# EAGLE design TriggerPI (EAGLE 6.5.0)
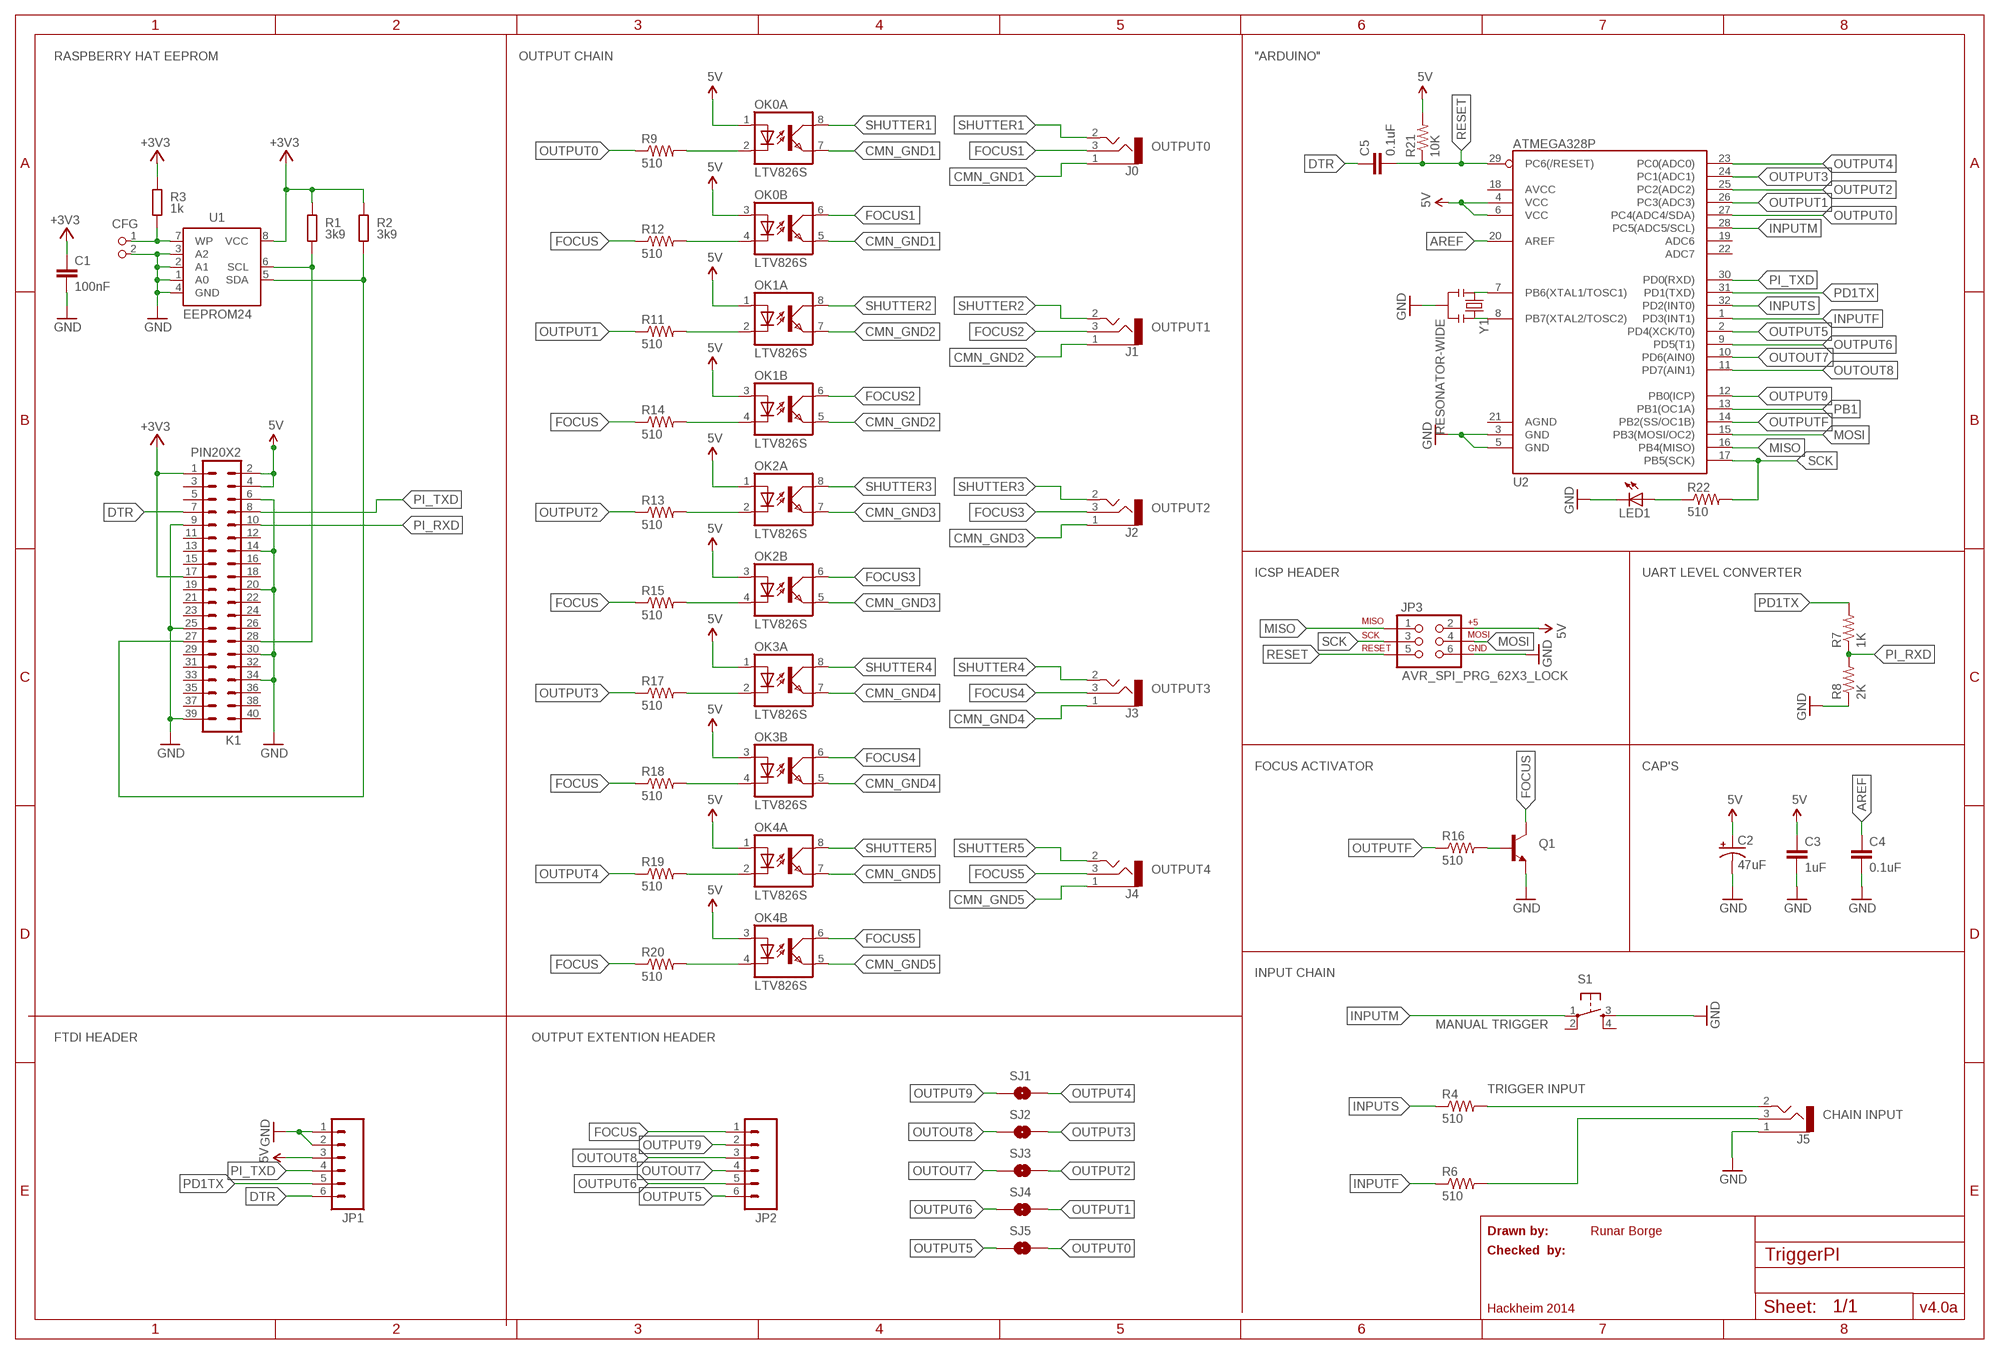
[diagram p0: schematic, sheet 1]

## Parts
C1  100nF  C-EUC0805K  [C0805K]
C2  47uF  47UF-TANT  [EIA3528]
C3  1uF  1UF-25V-10%(0805)  [0805]
C4  0.1uF  CAP0603-CAP  [0603-CAP]
C5  0.1uF  CAP0603-CAP  [0603-CAP]
CFG  PIN2_100  [PIN_W_2]
J0  AUDIO-3P'SJ-3523-SMT'  [3P-SMD-3.5]
J1  AUDIO-3P'SJ-3523-SMT'  [3P-SMD-3.5]
J2  AUDIO-3P'SJ-3523-SMT'  [3P-SMD-3.5]
J3  AUDIO-3P'SJ-3523-SMT'  [3P-SMD-3.5]
J4  AUDIO-3P'SJ-3523-SMT'  [3P-SMD-3.5]
J5  AUDIO-3P'SJ-3523-SMT'  [3P-SMD-3.5]
JP1  M06LOCK  [1X06_LOCK]
JP2  M06LOCK  [1X06_LOCK]
JP3  AVR_SPI_PRG_62X3_LOCK  [2X3_LOCK]
K1  PIN20X2  [PIN_20X2]
LED1  LED1206  [LED-1206]
OK0  LTV826S  [DIL8-SMD]
OK1  LTV826S  [DIL8-SMD]
OK2  LTV826S  [DIL8-SMD]
OK3  LTV826S  [DIL8-SMD]
OK4  LTV826S  [DIL8-SMD]
Q1  TRANSISTOR_NPNSOT23-3  [SOT23-3]
R1  3k9  R-EU_M0805  [M0805]
R2  3k9  R-EU_M0805  [M0805]
R3  1k  R-EU_M0805  [M0805]
R4  510  RESISTOR0603-RES  [0603-RES]
R6  510  RESISTOR0603-RES  [0603-RES]
R7  1K  RESISTOR0603-RES  [0603-RES]
R8  2K  RESISTOR0603-RES  [0603-RES]
R9  510  RESISTOR0603-RES  [0603-RES]
R11  510  RESISTOR0603-RES  [0603-RES]
R12  510  RESISTOR0603-RES  [0603-RES]
R13  510  RESISTOR0603-RES  [0603-RES]
R14  510  RESISTOR0603-RES  [0603-RES]
R15  510  RESISTOR0603-RES  [0603-RES]
R16  510  RESISTOR0603-RES  [0603-RES]
R17  510  RESISTOR0603-RES  [0603-RES]
R18  510  RESISTOR0603-RES  [0603-RES]
R19  510  RESISTOR0603-RES  [0603-RES]
R20  510  RESISTOR0603-RES  [0603-RES]
R21  10K  RESISTOR0603-RES  [0603-RES]
R22  510  RESISTOR0603-RES  [0603-RES]
S1  TAC_SWITCHSMD  [TACTILE_SWITCH_SMD]
SJ1  JUMPER-PAD-2-NOYES_SILK  [PAD-JUMPER-2-NO_YES_SILK]
SJ2  JUMPER-PAD-2-NOYES_SILK  [PAD-JUMPER-2-NO_YES_SILK]
SJ3  JUMPER-PAD-2-NOYES_SILK  [PAD-JUMPER-2-NO_YES_SILK]
SJ4  JUMPER-PAD-2-NOYES_SILK  [PAD-JUMPER-2-NO_YES_SILK]
SJ5  JUMPER-PAD-2-NOYES_SILK  [PAD-JUMPER-2-NO_YES_SILK]
U1  EEPROM24  [SOIC8]
U2  ATMEGA328P  ATMEGA328_SMT  [TQFP32-08]
Y1  RESONATOR-WIDE  [RESONATOR-WIDE-SMD]

## Nets
5V: C2.A(+) C3.1 JP1.3 JP3.2 K1.2 K1.4 OK0.1(A:A) OK0.3(B:A) OK1.1(A:A) OK1.3(B:A) OK2.1(A:A) OK2.3(B:A) OK3.1(A:A) OK3.3(B:A) OK4.1(A:A) OK4.3(B:A) R21.2 U2.4(VCC) U2.6(VCC)
+3V3: C1.1 K1.1 K1.17 R1.2 R2.2 R3.2 U1.8(VCC)
AREF: C4.1 U2.20(AREF)
CMN_GND1: J0.1 OK0.5(B:EMIT) OK0.7(A:EMIT)
CMN_GND2: J1.1 OK1.5(B:EMIT) OK1.7(A:EMIT)
CMN_GND3: J2.1 OK2.5(B:EMIT) OK2.7(A:EMIT)
CMN_GND4: J3.1 OK3.5(B:EMIT) OK3.7(A:EMIT)
CMN_GND5: J4.1 OK4.5(B:EMIT) OK4.7(A:EMIT)
DTR: C5.1 JP1.6 K1.7
FOCUS: JP2.1 Q1.3(C) R12.1 R14.1 R15.1 R18.1 R20.1
FOCUS0: J5.3 R6.2
FOCUS1: J0.3 OK0.6(B:COL)
FOCUS2: J1.3 OK1.6(B:COL)
FOCUS3: J2.3 OK2.6(B:COL)
FOCUS4: J3.3 OK3.6(B:COL)
FOCUS5: J4.3 OK4.6(B:COL)
GND: C1.2 C2.C(-) C3.2 C4.2 CFG.2 J5.1 JP1.1 JP1.2 JP3.6 K1.6 K1.9 K1.14 K1.20 K1.25 K1.30 K1.34 K1.39 LED1.C Q1.2(E) R8.1 S1.3 U1.1(A0) U1.2(A1) U1.3(A2) U1.4(GND) U2.3(GND) U2.5(GND) Y1.2
INPUTF: R6.1 U2.1(PD3(INT1))
INPUTM: S1.1 U2.28(PC5(ADC5/SCL))
INPUTS: R4.1 U2.32(PD2(INT0))
MISO: JP3.1 U2.16(PB4(MISO))
MOSI: JP3.4 U2.15(PB3(MOSI/OC2))
N$1: K1.28 R1.1 U1.6(SCL)
N$2: K1.27 R2.1 U1.5(SDA)
N$3: CFG.1 R3.1 U1.7(WP)
N$4: J5.2 R4.2
N$7: OK0.2(A:C) R9.2
N$9: OK1.2(A:C) R11.2
N$11: OK2.2(A:C) R13.2
N$12: OK0.4(B:C) R12.2
N$13: Q1.1(B) R16.2
N$14: OK3.2(A:C) R17.2
N$17: OK3.4(B:C) R18.2
N$18: OK4.2(A:C) R19.2
N$19: OK4.4(B:C) R20.2
N$20: U2.7(PB6(XTAL1/TOSC1)) Y1.1
N$21: U2.8(PB7(XTAL2/TOSC2)) Y1.3
N$24: LED1.A R22.1
N$26: OK1.4(B:C) R14.2
N$28: OK2.4(B:C) R15.2
OUTOUT7: JP2.4 SJ3.1 U2.10(PD6(AIN0))
OUTOUT8: JP2.3 SJ2.1 U2.11(PD7(AIN1))
OUTPUT0: R9.1 SJ5.2 U2.27(PC4(ADC4/SDA))
OUTPUT1: R11.1 SJ4.2 U2.26(PC3(ADC3))
OUTPUT2: R13.1 SJ3.2 U2.25(PC2(ADC2))
OUTPUT3: R17.1 SJ2.2 U2.24(PC1(ADC1))
OUTPUT4: R19.1 SJ1.2 U2.23(PC0(ADC0))
OUTPUT5: JP2.6 SJ5.1 U2.2(PD4(XCK/T0))
OUTPUT6: JP2.5 SJ4.1 U2.9(PD5(T1))
OUTPUT9: JP2.2 SJ1.1 U2.12(PB0(ICP))
OUTPUTF: R16.1 U2.14(PB2(SS/OC1B))
PB1: U2.13(PB1(OC1A))
PD1TX: JP1.5 R7.2 U2.31(PD1(TXD))
PI_RXD: K1.10 R7.1 R8.2
PI_TXD: JP1.4 K1.8 U2.30(PD0(RXD))
RESET: C5.2 JP3.5 R21.1 U2.29(PC6(/RESET))
SCK: JP3.3 R22.2 U2.17(PB5(SCK))
SHUTTER1: J0.2 OK0.8(A:COL)
SHUTTER2: J1.2 OK1.8(A:COL)
SHUTTER3: J2.2 OK2.8(A:COL)
SHUTTER4: J3.2 OK3.8(A:COL)
SHUTTER5: J4.2 OK4.8(A:COL)
Unconnected: K1.3 K1.5 K1.11 K1.12 K1.13 K1.15 K1.16 K1.18 K1.19 K1.21 K1.22 K1.23 K1.24 K1.26 K1.29 K1.31 K1.32 K1.33 K1.35 K1.36 K1.37 K1.38 K1.40 S1.2 S1.4 U2.18(AVCC) U2.19(ADC6) U2.21(AGND) U2.22(ADC7)

## Notes on the sheet
- RASPBERRY HAT EEPROM | OUTPUT CHAIN | "ARDUINO"
- OUTPUT0
- OUTPUT1
- OUTPUT2
- ICSP HEADER | UART LEVEL CONVERTER
- OUTPUT3
- FOCUS ACTIVATOR | CAP'S
- OUTPUT4
- INPUT CHAIN
- MANUAL TRIGGER
- FTDI HEADER | OUTPUT EXTENTION HEADER
- TRIGGER INPUT
- CHAIN INPUT
- Drawn by: | Runar Borge
- Checked  by:
- Hackheim 2014 | v4.0a

## Library data of the parts
C1 = resistor:C-EU: CAPACITOR, European symbol; DIELECTRIC: X7R
C2 = SparkFun-Capacitors:47UF-TANT: 47uF Tantalum SMT CAP-08310- 10V 10% (EIA-3528); DIGIKEY: 478-3132-1-ND; PROD_ID: CAP-08310
C3 = SparkFun-Capacitors:1UF-25V-10%(0805): CAP-08064; DIGIKEY: 445-7547-1-ND; PROD_ID: CAP-08064
C4 C5 = SparkFun-Capacitors:CAP: Capacitor Standard 0603 ceramic capacitor, and 0.1" leaded capacitor.; DIGIKEY: 445-1314-1-ND
CFG = FLYFISH:PIN2
J0 J1-J5 = Connector:AUDIO-3P: 3.5mm Audio Jack Simple 3.5mm common PCB mount audio jack. SKU: PRT-08032; DIGIKEY: CP-3523SJCT-ND
JP1 JP2 = SparkFun-Connectors:M06: Header 6 Standard 6-pin 0.1" header. Use with straight break away headers (SKU : PRT-00116), right angle break away headers (PRT-00553), swiss pins (PRT-00743), machine pins (PRT-00117), and female headers (PRT-00115). Molex polarized connector foot print use with SKU : PRT-08094 with associated crimp pins and housings. NOTES ON THE VARIANTS LOCK and LOCK_LONGPADS... This footprint was designed to help hold the alignment of a through-hole component (i.e. 6-pin header) while soldering it into place. You may notice that each hole has been shifted either up or down by 0.005 of an inch from it's more standard position (which is a perfectly straight line). This slight alteration caused the pins (the squares in the middle) to touch the edges of the holes. Because they are alternating, it causes a "brace" to hold the component in place. 0.005 has proven to be the perfect amount of "off-center" position when using our standard breakaway headers. Although looks a little odd when you look at the bare footprint, once you have a header in there, the alteration is very hard to notice. Also,if you push a header all the way into place, it is covered up entirely on the bottom side. This idea of altering the position of holes to aid alignment will be further integrated into the Sparkfun Library for other footprints. It can help hold any component with 3 or more connection pins.
JP3 = SparkFun-Connectors:AVR_SPI_PRG_6: AVR ISP 6 Pin This is the reduced ISP connector for AVR programming. Common on Arduino. This footprint will take up less PCB space and can be used with a 10-pin to 6-pin adapter such as SKU: BOB-08508
K1 = FLYFISH:PIN20X2
LED1 = SparkFun-LED:LED: LEDs Standard schematic elements and footprints for 5mm, 3mm, 1206, and 0603 sized LEDs. 5mm - Spark Fun Electronics SKU : COM-00529 (and others); DIGIKEY: 160-1405-1-ND
OK0 OK1-OK4 = optocoupler:LTV826: OPTO COUPLER Source: LITEON, LTV816.pdf; DIGIKEY: 160-1363-5-ND; OC_FARNELL: unknown; OC_NEWARK: unknown
Q1 = SparkFun-DiscreteSemi:TRANSISTOR_NPN: Generic NPN BJT. MMBT2222 is the common NPN we use. Double check against datasheet- not all devices are the same!; DIGIKEY: MMBT2222A-FDICT-ND
R1-R3 = resistor:R-EU_: RESISTOR, European symbol; TOLERANCE: 5%
R4 R6 R9 R11-R20 R22 = SparkFun-Passives:RESISTOR: Resistor Basic schematic elements and footprints for 0603, 1206, and PTH resistors.; DIGIKEY: RMCF0603JT510RCT-ND
R7 = SparkFun-Passives:RESISTOR: Resistor Basic schematic elements and footprints for 0603, 1206, and PTH resistors.; DIGIKEY: RMCF0603JT1K00CT-ND
R8 = SparkFun-Passives:RESISTOR: Resistor Basic schematic elements and footprints for 0603, 1206, and PTH resistors.; DIGIKEY: RMCF0603JT2K00CT-ND
R21 = SparkFun-Passives:RESISTOR: Resistor Basic schematic elements and footprints for 0603, 1206, and PTH resistors.; DIGIKEY: RMCF0603JT10K0CT-ND
S1 = SparkFun-Electromechanical:TAC_SWITCH: Momentary Switch Button commonly used for reset or general input. Spark Fun Electronics SKU : COM-00097 SMT- SWCH-08247; DIGIKEY: CKN9104CT-ND; PROD_ID: SWCH-08247
SJ1-SJ5 = SparkFun-Passives:JUMPER-PAD-2-NO
U1 = FLYFISH:EEPROM24
U2 = SparkFun-DigitalIC (Runars-iMac's conflicted copy 2013-11-01):ATMEGA328_SMT: 32-Pin Atmega328 part Commonly used on Arduino compatible boards Available in QFP and QFN packages TQFP is IC-09069 QFN is non-stock; DIGIKEY: ATMEGA328P-AURCT-ND; PROD_ID: IC-09069
Y1 = SparkFun-FreqCtrl:RESONATOR-WIDE; DIGIKEY: 1253-1084-1-ND

## Board
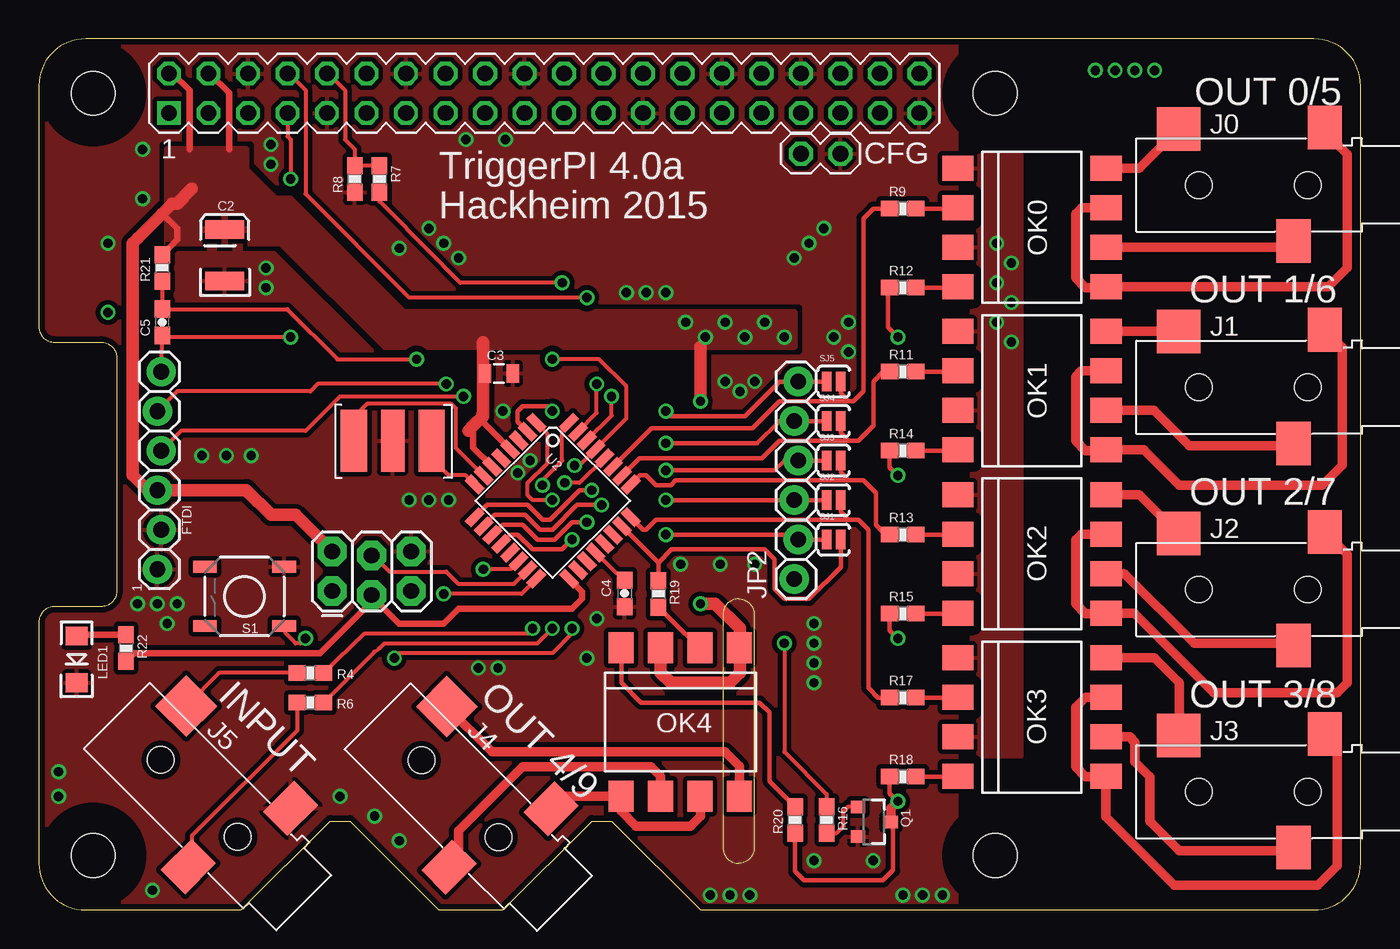
[diagram p1: board, top side]
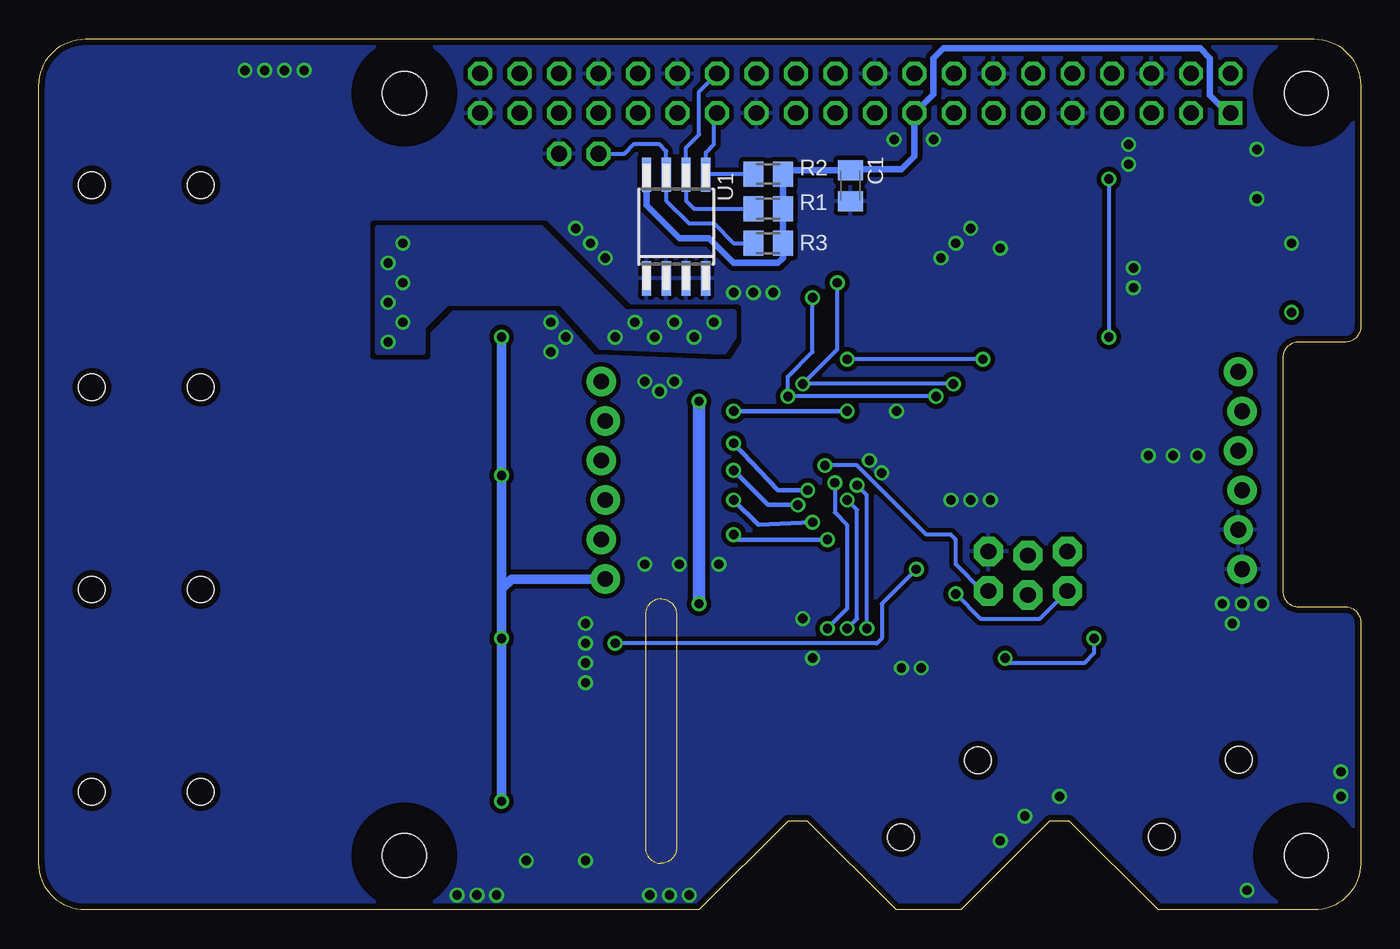
[diagram p2: board, bottom side, seen from below]

Size 85 x 56 mm. Coordinates in mm from the lower left corner, seen from the top.
Outline: 0,3 arc90 3,0 13.02,0 18.73,5.71 20,5.71 25.72,0 29.84,0 35.56,5.71 36.83,5.71 42.55,0 82,0 arc90 85,3 85,53 arc90 82,56 3,56 arc90 0,53 0,37.5 arc90 1,36.5 4,36.5 arc-90 5,35.5 5,20.5 arc-90 4,19.5 1,19.5 arc90 0,18.5 0,3
Copper layers (1*16): Top 0.0356mm / dielectric 1.5011mm / Bottom 0.0356mm
Design rules "OSHPark - LaenPCBOrder": minimum track width 6mil, minimum drill 13mil, track to track 6mil, track to pad 6mil, pad to pad 6mil, via to via 6mil, smd to smd 6mil, copper to edge 15mil, drill to drill 6mil, minimum pad ring 7mil, minimum via ring 7mil, stop-mask expansion 4mil, vias tented up to drill 0mil, thermal gap 10mil
Holes 2.8 mm at 3.5,3.5 3.5,52.5 61.5,52.5 61.5,3.5
tRestrict: area 1.9,51 to 5,54; area 60,51 to 63,54; area 60,1.9 to 63,5; area 1.9,1.9 to 5,5
bRestrict: area 1.9,1.9 to 5,5; area 1.9,51 to 5,54; area 60,1.9 to 63,5; area 60,51 to 63,54
Milling: 6 lines

### Footprints (pad centres in the part's own frame; a part is rotated, then mirrored left to right if it is on the bottom)
C0805K = smd 1.3 x 1.6: 1 -1,0; 2 1,0
EIA3528 = smd 1.2 x 2.5: A 1.65,0; C -1.65,0
0805 = smd 0.8 x 1.2: 1 -0.9,0; 2 0.9,0
0603-CAP = smd 1.1 x 1: 1 -0.85,0; 2 0.85,0
PIN_W_2 = drill 1.016 octagon: 1 0,0; 2 0,-2.54
3P-SMD-3.5 = smd 2.2 x 2.8: 1 4.6,3.7; 3 2.6,-3.6 | smd 2.8 x 2.8: 2 -4.8,3.6 | hole 1.7: -3.5,0; 3.5,0
1X06_LOCK = drill 1.016 pad 1.88: 1 0,0; 2 2.54,-0.254; 3 5.08,0; 4 7.62,-0.254; 5 10.16,0; 6 12.7,-0.254
2X3_LOCK = drill 1.016 pad 1.88 octagon: 1 0,0; 2 0,2.54; 3 2.54,-0.254; 4 2.54,2.286; 5 5.08,0; 6 5.08,2.54
PIN_20X2 = drill 1.016 square: 1 -24.13,-1.27 | drill 1.016 octagon: 2 -24.13,1.27; 3 -21.59,-1.27; 4 -21.59,1.27; 5 -19.05,-1.27; 6 -19.05,1.27; 7 -16.51,-1.27; 8 -16.51,1.27; 9 -13.97,-1.27; 10 -13.97,1.27; 11 -11.43,-1.27; 12 -11.43,1.27; 13 -8.89,-1.27; 14 -8.89,1.27; 15 -6.35,-1.27; 16 -6.35,1.27; 17 -3.81,-1.27; 18 -3.81,1.27; 19 -1.27,-1.27; 20 -1.27,1.27; 21 1.27,-1.27; 22 1.27,1.27; 23 3.81,-1.27; 24 3.81,1.27; 25 6.35,-1.27; 26 6.35,1.27; 27 8.89,-1.27; 28 8.89,1.27; 29 11.43,-1.27; 30 11.43,1.27; 31 13.97,-1.27; 32 13.97,1.27; 33 16.51,-1.27; 34 16.51,1.27; 35 19.05,-1.27; 36 19.05,1.27; 37 21.59,-1.27; 38 21.59,1.27; 39 24.13,-1.27; 40 24.13,1.27
LED-1206 = smd 1.2 x 1.4: A -1.5,0; C 1.5,0
DIL8-SMD = smd 1.6 x 2: 1 -3.81,-4.77; 2 -1.27,-4.77; 3 1.27,-4.77; 4 3.81,-4.77; 5 3.81,4.77; 6 1.27,4.77; 7 -1.27,4.77; 8 -3.81,4.77
SOT23-3 = smd 0.8 x 0.9: 1 -0.95,-1; 2 0.95,-1; 3 0,1.1
M0805 = smd 1.3 x 1.6: 1 -0.95,0; 2 0.95,0
0603-RES = smd 1.1 x 1: 1 -0.85,0; 2 0.85,0
TACTILE_SWITCH_SMD = smd 1.524 x 0.762: 1 -2.54,1.905; 2 2.54,1.905; 3 -2.54,-1.905; 4 2.54,-1.905
PAD-JUMPER-2-NO_YES_SILK = smd 0.635 x 1.27: 1 -0.45,0; 2 0.45,0
SOIC8 = smd 0.6 x 2.2: 1 -1.905,-3.33; 2 -0.635,-3.33; 3 0.635,-3.33; 4 1.905,-3.33; 5 1.905,3.33; 6 0.635,3.33; 7 -0.635,3.33; 8 -1.905,3.33
TQFP32-08 = smd 1.27 x 0.559: 1 -4.293,2.8; 2 -4.293,2; 3 -4.293,1.2; 4 -4.293,0.4; 5 -4.293,-0.4; 6 -4.293,-1.2; 7 -4.293,-2; 8 -4.293,-2.8; 17 4.293,-2.8; 18 4.293,-2; 19 4.293,-1.2; 20 4.293,-0.4; 21 4.293,0.4; 22 4.293,1.2; 23 4.293,2; 24 4.293,2.8 | smd 0.559 x 1.27: 9 -2.8,-4.293; 10 -2,-4.293; 11 -1.2,-4.293; 12 -0.4,-4.293; 13 0.4,-4.293; 14 1.2,-4.293; 15 2,-4.293; 16 2.8,-4.293; 25 2.8,4.293; 26 2,4.293; 27 1.2,4.293; 28 0.4,4.293; 29 -0.4,4.293; 30 -1.2,4.293; 31 -2,4.293; 32 -2.8,4.293
RESONATOR-WIDE-SMD = smd 1.7 x 4: 1 -2.5,0; 3 2.5,0 | smd 1.5 x 4: 2 0,0

### Placement (x,y rotation side)
C1  32.81,46.56 270 bottom
C2  11.95,42.09 90 top
C3  29.58,34.5 0 top
C4  37.67,20.35 270 top
C5  7.94,37.78 90 top
CFG  49.01,48.62 90 top
J0  78.09,46.6 0 top
J1  78.09,33.6 0 top
J2  78.09,20.6 0 top
J3  78.09,7.6 0 top
J4  27.08,7.14 315 top
J5  10.32,7.17 315 top
JP1  7.62,21.91 90 top
JP2  48.58,21.27 90 top
JP3  18.86,20.51 0 top
K1  32.5,52.5 0 top
LED1  2.43,16.11 270 top
OK0  63.86,43.88 270 top
OK1  63.86,33.39 270 top
OK2  63.86,22.89 270 top
OK3  63.86,12.4 270 top
OK4  41.26,12.09 180 top
Q1  53.69,5.66 270 top
R1  38.1,45.09 0 bottom
R2  38.1,47.31 0 bottom
R3  38.1,42.86 0 bottom
R4  17.46,15.24 180 top
R6  17.46,13.34 180 top
R7  21.91,46.99 270 top
R8  20.32,46.99 90 top
R9  55.56,45.09 0 top
R11  55.56,34.61 0 top
R12  55.56,40.01 0 top
R13  55.56,24.13 0 top
R14  55.56,29.53 0 top
R15  55.56,19.05 0 top
R16  50.66,5.79 270 top
R17  55.56,13.65 0 top
R18  55.56,8.57 0 top
R19  39.85,20.32 270 top
R20  48.63,5.79 90 top
R21  7.94,41.27 90 top
R22  5.61,16.84 270 top
S1  13.23,20.16 180 top
SJ1  51.12,23.81 0 top
SJ2  51.12,26.35 0 top
SJ3  51.12,28.89 0 top
SJ4  51.12,31.43 0 top
SJ5  51.12,33.97 0 top
U1  44.02,43.93 0 bottom
U2  33.05,26.3 315 top
Y1  22.75,30.17 0 top

### Tracks (layer width: path | path; a pad name or v marks a point on that pad's centre or on a via)
5V  (via drill 0.6)
  Top 0.254: 6.35,43.08 6.35,43.18
  Top 0.406: K1.2 8.62,53.77 9.68,52.7 9.68,48.9 | K1.4 11,53.77 12.22,52.55 12.22,48.9 | U2.4 28.31,31.6 C3.1 28.52,32.07 28.57,32.07 | U2.6 27.94,29.71 27.94,31.11 | R21.2 8.89,43.08 8.89,43.81 7.94,44.77
  Top 0.813: 28.57,36.51 28.57,32.07 28.57,31.75 27.94,31.11 27.62,30.8 | 9.84,46.35 8.89,45.4 8.57,45.4 7.94,44.77 6.35,43.18 6.03,42.86 6.03,27.94 6.99,26.99 JP1.3 13.34,26.99 14.92,25.4 16.51,25.4 JP3.2 | v42.55,19.68 43.5,19.68 45.09,18.1 45.09,16.88 OK4.1 45.09,16.84 45.09,15.24 44.45,14.61 40.64,14.61 39.98,15.26 OK4.3 | v42.55,32.7 42.55,36.2
  Bottom 0.813: v42.55,19.68 v42.55,32.7
  other vias: 41.59,37.78 42.86,36.83 44.13,37.78 45.4,36.83 46.67,37.78 47.94,36.83 61.59,42.86 62.55,41.59 61.59,40.32 62.55,39.05 61.59,37.78 62.55,36.51
  pour Top (isolate 0.61): 60.64,48.58 63.18,48.58 63.18,9.84 60.01,9.84 60.01,48.26
  pour Top (isolate 0.406): 13.34,48.9 8.26,48.9 8.26,42.86 15.56,42.86 22.23,36.2 48.58,36.2 48.58,38.42 23.5,38.42 16.19,45.72 15.24,45.72 13.34,47.62
  pour Bottom (isolate 0.406): 40.32,38.42 47.31,38.42 52.7,43.81 63.18,43.81 63.18,35.88 60.33,35.88 60.33,37.47 58.74,39.05 51.44,39.05 48.9,36.2 40.96,35.88 40.32,36.83
+3V3
  Bottom 0.406: U1.8 45.92,45.29 43.81,43.18 41.91,43.18 40.32,41.59 37.47,41.59 37.15,41.91 R3.2 R1.2 R2.2 36.9,47.56 C1.1 32.75,47.62 29.53,47.62 28.69,48.46 K1.17 27.46,52.46 27.46,54.77 26.83,55.4 10.32,55.4 9.68,54.77 9.68,52.39 8.53,51.23 K1.1
AREF
  Top 0.254: U2.20 37.04,21.74 C4.1
CMN_GND1
  Top 0.61: OK0.7 67.06,45.16 66.67,44.77 66.67,40.64 67.31,40.01 68.56,40.01 OK0.5 82.94,40.08 84.14,41.27 84.14,48.58 82.87,49.85 82.87,50.12 J0.1
CMN_GND2
  Top 0.61: OK1.7 67.05,34.66 66.67,34.29 66.67,30.16 67.31,29.53 68.58,29.53 OK1.5 71.07,29.58 73.34,27.3 82.55,27.3 83.82,28.57 83.82,36.17 J1.1
CMN_GND3
  Top 0.61: OK2.7 67.03,24.16 66.67,23.81 66.67,19.68 67.31,19.05 68.6,19.05 OK2.5 70.45,19.09 75.56,13.97 83.5,13.97 84.14,14.61 84.14,22.86 J2.1
CMN_GND4
  Top 0.61: OK3.7 67.33,13.67 66.67,13.02 66.67,9.21 67.31,8.57 68.61,8.57 OK3.5 68.63,5.98 73.03,1.59 82.23,1.59 83.5,2.86 83.5,10.49 J3.1
CMN_GND5
  Top 0.61: J4.1 33.76,7.32 OK4.5 37.45,6.37 38.42,5.4 41.91,5.4 42.55,6.03 42.55,7.29 OK4.7
DTR  (via drill 0.6)
  Top 0.254: JP1.6 7.94,36.51 8.03,36.51 8.19,36.68 C5.1 8.04,36.83 v16.19,36.83 | K1.7 15.99,49.73 16.19,49.53 v16.19,46.99
  Bottom 0.254: v16.19,46.99 v16.19,36.83
FOCUS  (via drill 0.6)
  Top 0.254: 54.61,39.9 R12.1 | 54.93,5.52 Q1.3
  Top 0.305: v55.24,36.83 54.61,37.47 54.61,39.9 | R14.1 54.71,28.47 v55.24,27.94 | R15.1 54.71,18 v55.24,17.46 | R18.1 54.71,7.52 v55.24,6.99 | R20.1 48.63,2.49 49.21,1.91 54.29,1.91 54.93,2.54 54.93,5.52
  Top 0.61: Q1.3 54.79,6.53 v55.24,6.99
  Bottom 0.61: v55.24,6.99 v55.24,17.46 55.24,20.64 | 55.24,20.64 v55.24,27.94 v55.24,36.83 | JP2.1 54.61,21.27 55.24,20.64
FOCUS0
  Top 0.254: R6.2 16.61,11.53 9.84,4.76 9.84,3.01 J5.3
FOCUS1
  Top 0.61: OK0.6 80.3,42.62 J0.3
FOCUS2
  Top 0.61: OK1.6 71.7,32.12 73.98,29.84 80.53,29.84 J1.3
FOCUS3
  Top 0.61: OK2.6 69.81,21.62 74.3,17.14 80.55,17.14 J2.3
FOCUS4
  Top 0.61: OK3.6 70.15,11.13 70.48,10.79 70.48,9.53 71.44,8.57 71.44,5.71 73.34,3.81 80.5,3.81 J3.3
FOCUS5
  Top 0.61: OK4.6 39.98,8.59 39.37,9.21 31.11,9.21 26.99,5.08 26.99,3.37 J4.3
GND  (via drill 0.6)
  other vias: 67.94,53.98 69.22,53.98 70.48,53.98 71.75,53.98 30.8,28.1 26.35,26.35 31.59,28.89 19.37,7.3 21.59,6.03 23.18,4.45 6.35,19.68 8.26,18.41 8.89,19.68 7.62,19.68 25.08,26.35 7.3,1.27 1.27,8.89 1.27,7.3 28.26,15.56 29.53,15.56 35.24,16.19 35.88,18.73 41.27,22.23 46.04,22.23 45.72,0.95 43.81,22.23 49.85,14.61 44.45,0.95 43.18,0.95 49.85,18.41 49.85,17.14 49.85,15.88 46.04,33.97 45.09,33.34 44.13,33.97 26.99,41.91 26.04,42.86 25.08,43.81 23.18,42.55 14.61,41.27 14.61,40.01 55.56,0.95 56.83,0.95 58.1,0.95 6.67,48.9 6.67,45.72 4.45,42.86 14.92,49.21 14.92,47.94 48.58,41.91 49.53,42.86 50.48,43.81 52.07,37.78 51.12,36.83 52.07,35.88 40.32,39.69 39.05,39.69 37.78,39.69 23.81,26.35 10.48,29.21 12.06,29.21 13.65,29.21 27.46,49.53 30,49.53 29.84,32.07 53.66,3.17 49.85,3.17
  pour Bottom (isolate 0.305, rank 2): 0,3 arc90 3,0 82,0 arc90 85,3 85,53 arc90 82,56 3,56 arc90 0,53 0,37.5 arc90 1,36.5 4,36.5 arc-90 5,35.5 5,20.5 arc-90 4,19.5 1,19.5 arc90 0,18.5
  pour Top (isolate 0.305, rank 2): 0,3 arc90 3,0 59.05,0 59.05,55.88 3,56 arc90 0,53 0,37.5 arc90 1,36.5 4,36.5 arc-90 5,35.5 5,20.5 arc-90 4,19.5 1,19.5 arc90 0,18.5
INPUTF  (via drill 0.6)
  Top 0.254: R6.1 21.59,16.61 21.91,16.83 22.23,17.14 32.07,17.14 v33.02,18.1 | v33.02,26.35 31.75,26.35 31.43,26.67 31.43,27.46 32.7,28.73 32.7,30.61 U2.1
  Bottom 0.254: v33.02,18.1 32.38,18.73 32.38,25.72 v33.02,26.35
INPUTM  (via drill 0.6)
  Top 0.254: U2.28 34.77,27.45 v33.81,27.46 | v34.29,18.1 34.29,17.78 33.02,16.51 23.18,16.51 v22.86,16.19 | v17.14,17.46 16.83,17.14 16.51,17.14 15.88,17.78 15.88,18.15 S1.1
  Bottom 0.254: v33.81,27.46 33.81,25.56 33.02,24.77 33.02,19.37 v34.29,18.1 | v17.14,17.46 17.14,16.51 17.78,15.88 22.54,15.88 v22.86,16.19
INPUTS  (via drill 0.6)
  Top 0.254: R4.1 20.95,17.78 31.43,17.78 v31.75,18.1 | v32.38,27.3 32.38,27.62 33.66,28.89 33.66,30.87 U2.32
  Bottom 0.254: v31.75,18.1 31.75,26.67 v32.38,27.3
MISO  (via drill 0.6)
  Top 0.254: U2.16 31.03,20.32 v26.04,20.32
  Bottom 0.254: v26.04,20.32 24.45,18.73 20.64,18.73 JP3.1
MOSI
  Top 0.254: U2.15 30.53,20.95 26.99,20.95 26.19,21.75 22.54,21.75 21.5,22.79 JP3.4
N$1
  Bottom 0.254: K1.28 42.55,52.62 42.55,49.85 43.38,49.01 U1.6 43.38,45.61 42.86,45.09 R1.1
N$2
  Bottom 0.254: K1.27 41.59,51.03 41.59,49.21 42.12,48.69 U1.5 42.07,47.31 R2.1
N$3
  Bottom 0.254: R3.1 40.32,42.86 41.59,44.13 43.18,44.13 44.66,45.61 U1.7 44.66,48.78 45.09,49.21 46.76,49.21 47.35,48.62 CFG.1
N$4
  Top 0.254: R4.2 11.61,15.24 J5.2
N$7
  Top 0.254: 59.02,45.09 OK0.2
  Top 0.305: R9.2 59.02,45.09
N$9
  Top 0.254: 59.04,34.61 OK1.2
  Top 0.305: R11.2 59.04,34.61
N$11
  Top 0.254: 59.06,24.13 OK2.2
  Top 0.305: R13.2 59.06,24.13
N$12
  Top 0.254: 59.02,40.01 OK0.4
  Top 0.305: R12.2 59.02,40.01
N$13
  Top 0.254: R16.2 51.29,4.94 51.75,5.4 51.75,6.35 52.07,6.67 52.63,6.67 Q1.1
N$14
  Top 0.254: 59.08,13.65 OK3.2
  Top 0.305: R17.2 59.08,13.65
N$15  (via drill 0.6)
  other vias: 4.45,38.42
N$17
  Top 0.254: 59.08,8.57 OK3.4
  Top 0.305: R18.2 59.08,8.57
N$18
  Top 0.305: R19.2 41.26,18.06 OK4.2
N$19
  Top 0.254: 37.47,16.84 OK4.4
  Top 0.305: 37.47,16.84 37.47,14.61 38.73,13.34 46.35,13.34 46.99,12.7 46.99,8.28 R20.2
N$20
  Top 0.254: U2.7 26.99,29.53 26.83,29.69 26.83,32.23 26.51,32.54 21.11,32.54 20.32,31.75 20.32,30.24 Y1.1
N$21
  Top 0.254: U2.8 27.45,27.94 26.35,27.94 25.25,29.04 Y1.3
N$24
  Top 0.406: R22.1 2.51,17.69 LED1.A
N$26
  Top 0.254: 59.04,29.53 OK1.4
  Top 0.305: R14.2 59.04,29.53
N$28
  Top 0.254: 59.06,19.05 OK2.4
  Top 0.305: R15.2 59.06,19.05
OUTOUT7  (via drill 0.6)
  Top 0.254: 47.31,28.26 47.94,28.89 JP2.4
  Top 0.305: U2.10 29.32,25.4 31.27,25.4 32.23,24.45 33.02,24.45 34.61,26.04 v36.2,26.04 | v40.32,28.26 47.31,28.26 | SJ3.1 JP2.4
  Bottom 0.305: v36.2,26.04 38.1,26.04 v40.32,28.26
OUTOUT8  (via drill 0.6)
  Top 0.305: U2.11 29.82,24.77 31.11,24.77 32.07,23.81 33.18,23.81 34.29,24.92 v35.24,24.92 | v40.32,26.35 JP2.3 SJ2.1
  Bottom 0.305: v35.24,24.92 38.73,24.77 v40.32,26.35
OUTPUT0
  Top 0.305: R9.1 53.66,45.09 53.02,44.45 53.02,33.34 52.39,32.7 52.07,32.7 | U2.27 39.4,30.96 45.88,30.96 47.62,32.7 52.07,32.7 | SJ5.2 51.57,33.2 52.07,32.7
OUTPUT1
  Top 0.254: R11.1 54.29,34.61
  Top 0.305: 54.29,34.61 53.66,33.97 53.66,31.11 52.7,30.16 52.07,30.16 | U2.26 38.63,29.05 46.51,29.05 47.62,30.16 52.07,30.16 | SJ4.2 51.57,30.66 52.07,30.16
OUTPUT2
  Top 0.254: R13.1 54.29,24.29
  Top 0.305: 54.29,24.29 53.82,24.77 53.82,26.83 53.02,27.62 52.07,27.62 | U2.25 38.65,27.94 39.05,27.94 39.69,27.3 40.64,27.3 40.96,27.62 52.07,27.62 | SJ3.2 51.57,28.12 52.07,27.62
OUTPUT3
  Top 0.305: R17.1 53.98,13.65 53.34,14.29 53.34,24.45 52.7,25.08 52.07,25.08 | U2.24 38.86,24.45 39.05,24.45 39.69,25.08 52.07,25.08 | SJ2.2 51.57,25.59 52.07,25.08
OUTPUT4
  Top 0.305: U2.23 39.85,22.33 | 39.85,22.33 R19.1 | SJ1.2 51.57,22.04 49.53,20 47.94,20 47.31,20.64 47.31,22.54 46.67,23.18 40.69,23.18 39.85,22.33
OUTPUT5  (via drill 0.6)
  Top 0.305: U2.2 30.8,31.38 30.8,32.07 31.11,32.38 32.7,32.38 v33.02,32.07 | v40.32,32.07 40.64,31.75 45.4,31.75 47.62,33.97 JP2.6 SJ5.1
  Bottom 0.305: v33.02,32.07 v40.32,32.07
OUTPUT6  (via drill 0.6)
  Top 0.254: 46.2,30 47.62,31.43 JP2.5
  Top 0.305: U2.9 28.82,26.04 31.43,26.04 32.38,25.08 32.86,25.08 34.77,26.99 v35.56,26.99 | v40.32,30 46.2,30 | SJ4.1 JP2.5
  Bottom 0.305: v35.56,26.99 37.47,26.99 v40.32,30
OUTPUT9  (via drill 0.6)
  Top 0.305: U2.12 30.31,24.13 30.8,24.13 31.75,23.18 33.66,23.18 v34.29,23.81 | v40.32,24.13 48.51,24.13 JP2.2 SJ1.1
  Bottom 0.305: v34.29,23.81 40.01,23.81 v40.32,24.13
OUTPUTF  (via drill 0.6)
  Top 0.254: U2.14 30.35,21.91 v28.57,21.91 | v47.94,17.14 47.94,10.16 50.66,7.45 R16.1
  Bottom 0.254: v28.57,21.91 30.8,19.68 30.8,17.46 31.11,17.14 v47.94,17.14
PD1TX  (via drill 0.6)
  Top 0.254: U2.31 35.88,31.96 v35.88,33.81 | v33.66,40.32 27.09,40.32 22.54,44.93 21.91,45.56 R7.2 | v26.19,33.81 17.94,33.81 17.46,33.34 8.89,33.34 JP1.5
  Bottom 0.254: v33.66,40.32 33.66,36.04 v35.88,33.81 v26.19,33.81
PI_RXD
  Top 0.254: K1.10 18.62,53.77 19.68,52.7 19.68,49.53 20.32,48.9 R8.2 R7.1
PI_TXD  (via drill 0.6)
  Top 0.254: K1.8 16.08,53.77 17.14,52.7 17.14,46.04 23.81,39.37 v35.24,39.37 | v27.3,33.02 19.37,33.02 17.14,30.8 9.14,30.8 JP1.4 | U2.30 36.83,31.78 v36.83,33.02
  Bottom 0.254: v35.24,39.37 35.24,35.88 36.83,34.29 v36.83,33.02 v27.3,33.02
RESET  (via drill 0.6)
  Top 0.254: v34.45,28.57 34.92,28.74 U2.29 37.78,31.6 37.78,33.66 36.04,35.4 v33.02,35.4 | R21.1 C5.2 15.98,38.63 19.21,35.4 v24.29,35.4
  Bottom 0.254: JP3.5 24.32,20.51 26.04,22.23 26.04,23.81 26.35,24.13 27.94,24.13 32.38,28.57 v34.45,28.57 | v24.29,35.4 v33.02,35.4
SCK
  Top 0.406: U2.17 34.92,20.46 34.92,20 34.29,19.37 26.99,19.37 26.04,18.41 23.18,18.41 21.4,20.19 | 21.4,20.19 JP3.3 | 21.4,20.19 21.4,19.82 18.1,16.51 6.13,16.51 R22.2
SHUTTER1
  Top 0.61: OK0.8 70.78,47.7 J0.2
SHUTTER2
  Top 0.61: OK1.8 J1.2
SHUTTER3
  Top 0.61: OK2.8 70.79,26.7 J2.2
SHUTTER4
  Top 0.61: OK3.8 71.74,16.21 73.34,14.61 73.34,11.26 J3.2
SHUTTER5
  Top 0.61: OK4.8 45.06,9.23 44.13,10.16 29.15,10.16 J4.2

### Text on the board
tPlace: OUT 0/5 | TriggerPI 4.0a | Hackheim 2015 | OUT 1/6 | OUT 2/7 | FTDI | 1 | INPUT | OUT 4/9 | OUT 3/8